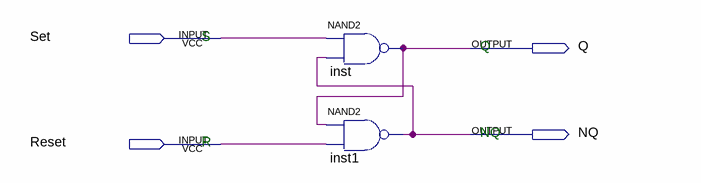
[diagram p0: schematic sheet]
// Quartus schematic SR_Latch.bdf as structural Verilog: 2 symbols, 4 pins
module SR_Latch (
  input  Set,
  input  Reset,
  output Q,
  output NQ
);

  nand inst (Q, Set, NQ);
  nand inst1 (NQ, Q, Reset);

  // Notes on the sheet:
  //   S
  //   Q
  //   NQ
  //   R
endmodule
